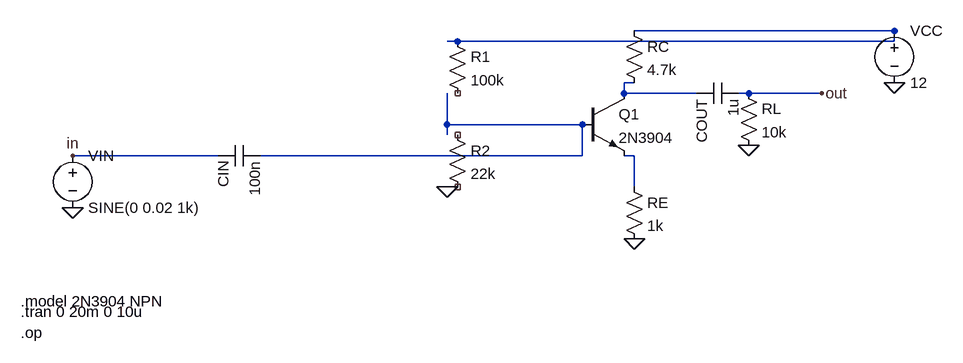
[diagram p0: schematic common_emitter_npn.asc]
common_emitter_npn.asc, the LTspice schematic file:
Version 4
SHEET 1 2000 1300
WIRE 128 368 352 368
WIRE 416 368 912 368
WIRE 912 368 912 320
WIRE 704 272 704 320
WIRE 704 320 912 320
WIRE 704 336 704 320
WIRE 992 256 976 256
WIRE 976 256 976 272
WIRE 976 272 1088 272
WIRE 1152 272 1168 272
WIRE 976 368 992 368
WIRE 992 368 992 416
WIRE 1392 176 992 176
WIRE 1392 176 1392 192
WIRE 1392 192 704 192
WIRE 1168 272 1280 272
FLAG 128 368 in
FLAG 1280 272 out
FLAG 128 448 0
FLAG 1392 256 0
FLAG 704 416 0
FLAG 992 496 0
FLAG 1168 352 0
SYMBOL voltage 128 352 R0
SYMATTR InstName VIN
SYMATTR Value SINE(0 0.02 1k)
SYMBOL cap 352 352 M90
SYMATTR InstName CIN
SYMATTR Value 100n
SYMBOL npn 912 272 R0
SYMATTR InstName Q1
SYMATTR Value 2N3904
SYMBOL res 704 176 R0
SYMATTR InstName R1
SYMATTR Value 100k
SYMBOL res 704 320 R0
SYMATTR InstName R2
SYMATTR Value 22k
SYMBOL res 976 160 R0
SYMATTR InstName RC
SYMATTR Value 4.7k
SYMBOL res 976 400 R0
SYMATTR InstName RE
SYMATTR Value 1k
SYMBOL cap 1088 256 M90
SYMATTR InstName COUT
SYMATTR Value 1u
SYMBOL res 1152 256 R0
SYMATTR InstName RL
SYMATTR Value 10k
SYMBOL voltage 1392 160 R0
SYMATTR InstName VCC
SYMATTR Value 12
TEXT 48 592 Left 2 !.model 2N3904 NPN
TEXT 48 608 Left 2 !.tran 0 20m 0 10u
TEXT 48 640 Left 2 !.op

The netlist it stands for:
* common_emitter_npn.asc
VIN in 0 SINE(0 0.02 1k)
CIN in N001 100n
Q1 N002 N001 N003 0 2N3904
R1 N004 NC_01 100k
R2 NC_02 NC_03 22k
RC N004 N002 4.7k
RE N003 0 1k
COUT N002 out 1u
RL out 0 10k
VCC N004 0 12
.model NPN NPN
.model PNP PNP
.lib standard.bjt
.model 2N3904 NPN
.tran 0 20m 0 10u
.op
.backanno
.end